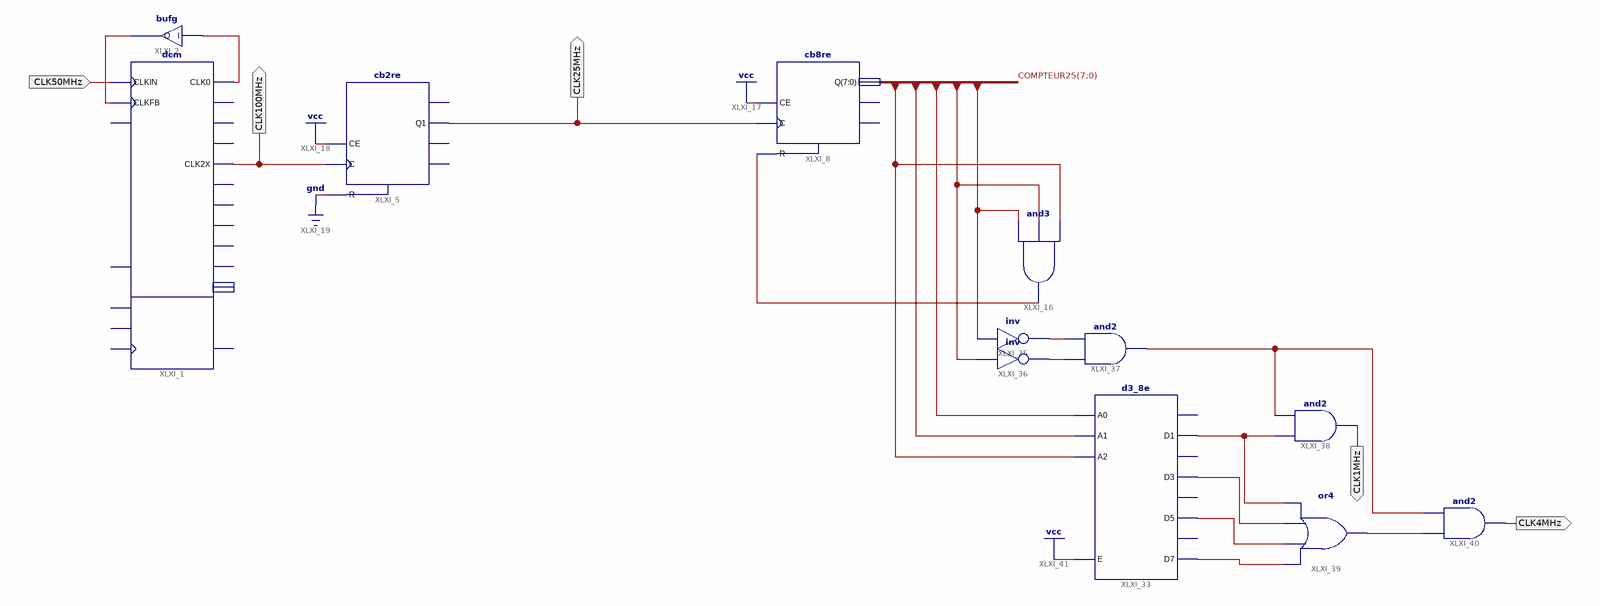
[diagram p0: schematic sheet 1]
// Xilinx ISE schematic CLK_commander.sch (spartan3) as structural Verilog: 12 symbols, 5 ports
module CLK_commander (
  input  CLK50MHz,
  output CLK100MHz,
  output CLK25MHz,
  output CLK1MHz,
  output CLK4MHz
);

  wire XLXN_2, XLXN_3, XLXN_31, XLXN_215, XLXN_216, XLXN_218, XLXN_220, XLXN_221, XLXN_223, XLXN_224,
       XLXN_225;
  wire [7:0] COMPTEUR25;

  cb2re XLXI_5 (.C(CLK100MHz), .CE(1'b1), .R(1'b0), .Q1(CLK25MHz));  // open: CEO, Q0, TC
  cb8re XLXI_8 (.C(CLK25MHz), .CE(1'b1), .R(XLXN_31), .Q(COMPTEUR25));  // open: CEO, TC
  and XLXI_16 (XLXN_31, COMPTEUR25[4], COMPTEUR25[3], COMPTEUR25[0]);
  dcm XLXI_1 (
    .CLKFB(XLXN_3), .CLKIN(CLK50MHz), .CLK0(XLXN_2), .CLK2X(CLK100MHz));  // open: DSSEN, PSCLK, PSEN, PSINCDEC, RST, CLK180, CLK270, CLK2X180, CLK90, CLKDV, CLKFX, CLKFX180, LOCKED, PSDONE, STATUS
  bufg XLXI_2 (.I(XLXN_2), .O(XLXN_3));
  d3_8e XLXI_33 (
    .A0(COMPTEUR25[2]), .A1(COMPTEUR25[1]), .A2(COMPTEUR25[0]), .E(1'b1), .D1(XLXN_220), .D3(XLXN_221),
    .D5(XLXN_223), .D7(XLXN_224));  // open: D0, D2, D4, D6
  not XLXI_35 (XLXN_215, COMPTEUR25[4]);
  not XLXI_36 (XLXN_216, COMPTEUR25[3]);
  and XLXI_37 (XLXN_218, XLXN_216, XLXN_215);
  and XLXI_38 (CLK1MHz, XLXN_220, XLXN_218);
  or XLXI_39 (XLXN_225, XLXN_224, XLXN_223, XLXN_221, XLXN_220);
  and XLXI_40 (CLK4MHz, XLXN_225, XLXN_218);
endmodule
